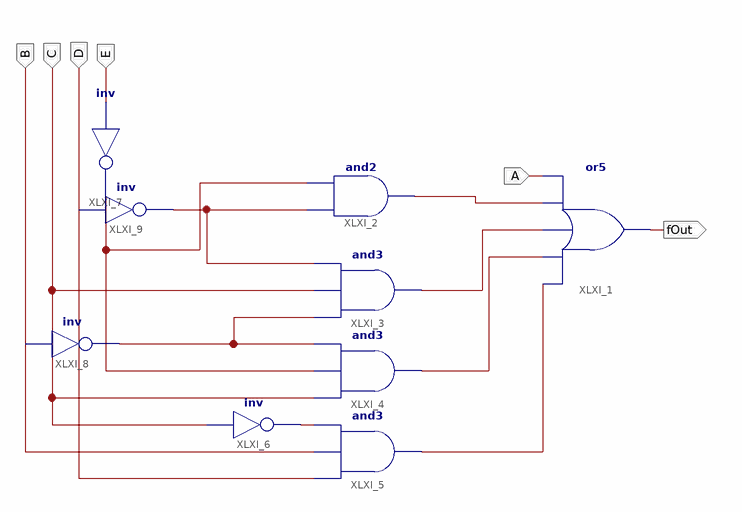
[diagram p0: schematic sheet 1]
// Xilinx ISE schematic f.sch (xa9500xl) as structural Verilog: 9 symbols, 6 ports
module f (
  input  A,
  input  B,
  input  C,
  input  D,
  input  E,
  output fOut
);

  wire XLXN_1, XLXN_2, XLXN_3, XLXN_4, XLXN_13, XLXN_15, XLXN_17, XLXN_19;

  or XLXI_1 (fOut, XLXN_4, XLXN_3, XLXN_2, XLXN_1, A);
  and XLXI_2 (XLXN_1, XLXN_19, XLXN_15);
  and XLXI_3 (XLXN_2, XLXN_17, C, XLXN_19);
  and XLXI_4 (XLXN_3, C, XLXN_15, XLXN_17);
  and XLXI_5 (XLXN_4, D, B, XLXN_13);
  not XLXI_6 (XLXN_13, C);
  not XLXI_7 (XLXN_15, E);
  not XLXI_8 (XLXN_17, B);
  not XLXI_9 (XLXN_19, D);
endmodule
